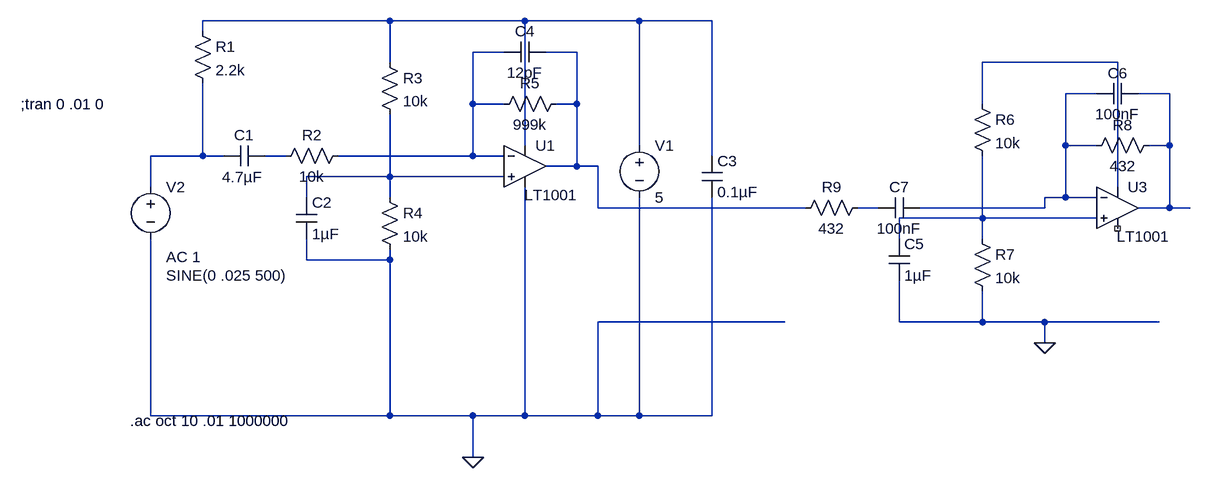
[diagram p0: schematic mic_amp.asc]
mic_amp.asc, the LTspice schematic file:
Version 4
SHEET 1 1380 680
WIRE 144 -64 -144 -64
WIRE 352 -64 144 -64
WIRE 528 -64 352 -64
WIRE 640 -64 528 -64
WIRE -144 -48 -144 -64
WIRE 320 -16 272 -16
WIRE 432 -16 384 -16
WIRE 144 0 144 -64
WIRE 1264 0 1056 0
WIRE 1232 48 1184 48
WIRE 1344 48 1296 48
WIRE 272 64 272 -16
WIRE 320 64 272 64
WIRE 432 64 432 -16
WIRE 432 64 400 64
WIRE 1056 64 1056 0
WIRE 352 128 352 -64
WIRE 528 128 528 -64
WIRE 1184 128 1184 48
WIRE 1232 128 1184 128
WIRE 1344 128 1344 48
WIRE 1344 128 1312 128
WIRE -144 144 -144 32
WIRE -144 144 -224 144
WIRE -112 144 -144 144
WIRE -16 144 -48 144
WIRE 272 144 272 64
WIRE 272 144 64 144
WIRE 320 144 272 144
WIRE 640 144 640 -64
WIRE 432 160 432 64
WIRE 432 160 384 160
WIRE 464 160 432 160
WIRE 144 176 144 80
WIRE 144 176 16 176
WIRE 320 176 144 176
WIRE -224 192 -224 144
WIRE 1264 192 1264 0
WIRE 16 208 16 176
WIRE 144 208 144 176
WIRE 1184 208 1184 128
WIRE 1184 208 1152 208
WIRE 1232 208 1184 208
WIRE 464 224 464 160
WIRE 784 224 464 224
WIRE 896 224 864 224
WIRE 1152 224 1152 208
WIRE 1152 224 960 224
WIRE 1344 224 1344 128
WIRE 1344 224 1296 224
WIRE 1376 224 1344 224
WIRE 1056 240 1056 144
WIRE 1056 240 928 240
WIRE 1232 240 1056 240
WIRE 928 272 928 240
WIRE 1056 272 1056 240
WIRE 16 304 16 272
WIRE 144 304 144 288
WIRE 144 304 16 304
WIRE 752 400 464 400
WIRE 928 400 928 336
WIRE 1056 400 1056 352
WIRE 1056 400 928 400
WIRE 1152 400 1056 400
WIRE 1328 400 1152 400
WIRE 1152 432 1152 400
WIRE -224 544 -224 272
WIRE 144 544 144 304
WIRE 144 544 -224 544
WIRE 272 544 144 544
WIRE 352 544 352 192
WIRE 352 544 272 544
WIRE 464 544 464 400
WIRE 464 544 352 544
WIRE 528 544 528 208
WIRE 528 544 464 544
WIRE 640 544 640 208
WIRE 640 544 528 544
WIRE 272 608 272 544
FLAG 272 608 0
FLAG 1152 432 0
SYMBOL Opamps\\LT1001 352 96 R0
WINDOW 3 -1 108 Left 2
SYMATTR InstName U1
SYMBOL voltage 528 112 R0
WINDOW 123 0 0 Left 2
WINDOW 39 0 0 Left 2
SYMATTR InstName V1
SYMATTR Value 5
SYMBOL voltage -224 176 R0
WINDOW 3 24 152 Left 2
WINDOW 123 24 124 Left 2
WINDOW 39 0 0 Left 2
SYMATTR Value SINE(0 .025 500)
SYMATTR Value2 AC 1
SYMATTR InstName V2
SYMBOL res -160 -64 R0
SYMATTR InstName R1
SYMATTR Value 2.2k
SYMBOL res 80 128 R90
WINDOW 0 0 56 VBottom 2
WINDOW 3 32 56 VTop 2
SYMATTR InstName R2
SYMATTR Value 10k
SYMBOL cap -48 128 R90
WINDOW 0 0 32 VBottom 2
WINDOW 3 33 35 VTop 2
SYMATTR InstName C1
SYMATTR Value 4.7µF
SYMBOL res 128 -16 R0
SYMATTR InstName R3
SYMATTR Value 10k
SYMBOL res 128 192 R0
SYMATTR InstName R4
SYMATTR Value 10k
SYMBOL cap 0 208 R0
SYMATTR InstName C2
SYMATTR Value 1µF
SYMBOL cap 624 144 R0
SYMATTR InstName C3
SYMATTR Value 0.1µF
SYMBOL res 416 48 R90
WINDOW 0 0 56 VBottom 2
WINDOW 3 32 56 VTop 2
SYMATTR InstName R5
SYMATTR Value 999k
SYMBOL cap 384 -32 R90
WINDOW 0 0 32 VBottom 2
WINDOW 3 32 32 VTop 2
SYMATTR InstName C4
SYMATTR Value 12pF
SYMBOL Opamps\\LT1001 1264 160 R0
WINDOW 3 -1 108 Left 2
SYMATTR InstName U3
SYMBOL res 1040 48 R0
SYMATTR InstName R6
SYMATTR Value 10k
SYMBOL res 1040 256 R0
SYMATTR InstName R7
SYMATTR Value 10k
SYMBOL cap 912 272 R0
SYMATTR InstName C5
SYMATTR Value 1µF
SYMBOL res 1328 112 R90
WINDOW 0 0 56 VBottom 2
WINDOW 3 32 56 VTop 2
SYMATTR InstName R8
SYMATTR Value 432
SYMBOL cap 1296 32 R90
WINDOW 0 0 32 VBottom 2
WINDOW 3 32 32 VTop 2
SYMATTR InstName C6
SYMATTR Value 100nF
SYMBOL res 880 208 R90
WINDOW 0 0 56 VBottom 2
WINDOW 3 32 56 VTop 2
SYMATTR InstName R9
SYMATTR Value 432
SYMBOL cap 960 208 R90
WINDOW 0 0 32 VBottom 2
WINDOW 3 32 32 VTop 2
SYMATTR InstName C7
SYMATTR Value 100nF
TEXT -256 552 Left 2 !.ac oct 10 .01 1000000
TEXT -424 64 Left 2 !;tran 0 .01 0

The netlist it stands for:
* mic_amp.asc
XU1 N009 N002 N001 0 N003 LT1001  ; pins In+ In- V+ V- OUT
V1 N001 0 5
V2 N007 0 SINE(0 .025 500) AC 1
R1 N001 N007 2.2k
R2 N002 N008 10k
C1 N008 N007 4.7µF
R3 N001 N009 10k
R4 N009 0 10k
C2 N009 0 1µF
C3 N001 0 0.1µF
R5 N003 N002 999k
C4 N003 N002 12pF
XU3 N011 N005 N004 NC_01 N006 LT1001  ; pins In+ In- V+ V- OUT
R6 N004 N011 10k
R7 N011 0 10k
C5 N011 0 1µF
R8 N006 N005 432
C6 N006 N005 100nF
R9 N010 N003 432
C7 N005 N010 100nF
.ac oct 10 .01 1000000
;tran 0 .01 0
.lib LTC.lib
.backanno
.end